# Altium project Shield.PrjPcb
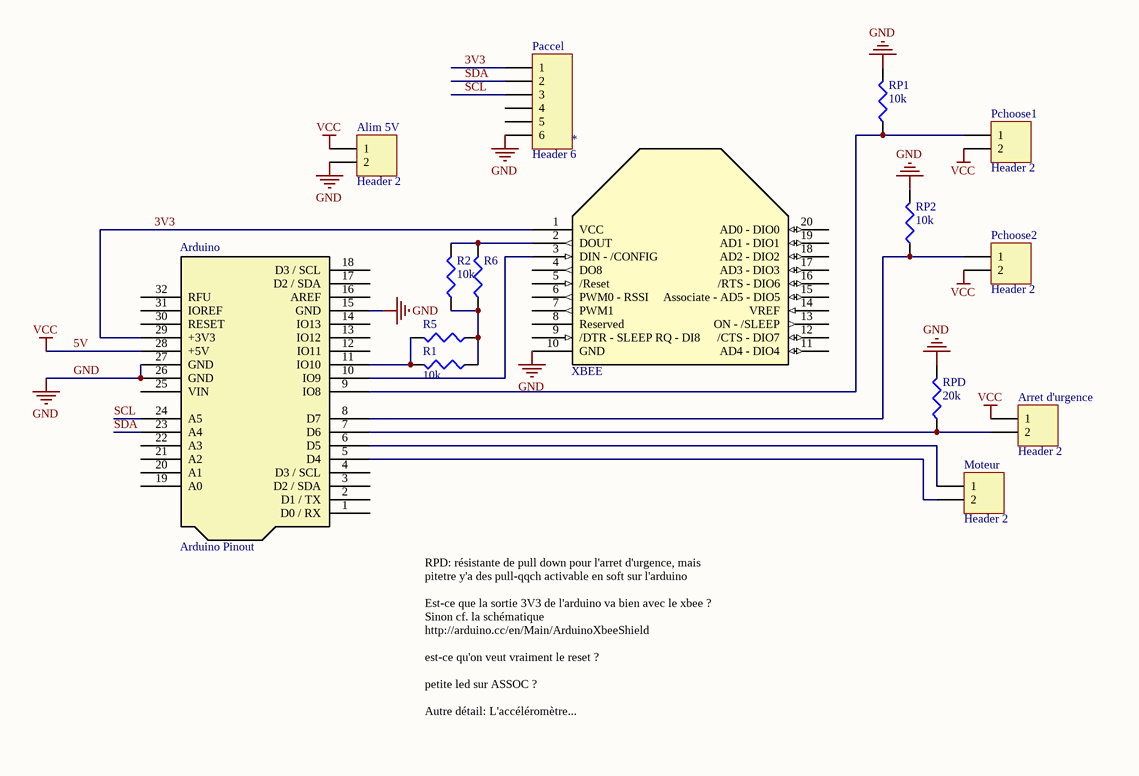
[diagram p0: Main.SchDoc]
1 sheet, 15 parts. Net scope: global (net labels, ports and power ports of the same name join across sheets).

## Sheet Main.SchDoc
size A4

### Parts
*  XBEE  [XBEE]
Alim_5V  Header 2  [TERM2W-3.5]
Arduino  Arduino Pinout  [Arduino]
Arret_d'urgence  Header 2  [HDR1X2]
Moteur  Header 2  [HDR1X2]
Paccel  Header 6  [HDR1X6]
Pchoose1  Header 2  [HDR1X2]
Pchoose2  Header 2  [HDR1X2]
R1  value 10k  [AXIAL0.8]  (hidden comment: RES)
R2  value 10k  [AXIAL0.8]  (hidden comment: RES)
R5  RES  [AXIAL0.8]  (value not drawn)
R6  RES  [AXIAL0.8]  (value not drawn)
RP1  value 10k  [AXIAL0.8]  (hidden comment: RES)
RP2  value 10k  [AXIAL0.8]  (hidden comment: RES)
RPD  value 20k  [AXIAL0.8]  (hidden comment: RES)

### Nets
5V: Alim_5V.1 Arduino.28(+5V) Arret_d'urgence.1 Pchoose1.2 Pchoose2.2  [also labelled VCC]
GND: *.10(GND) Alim_5V.2 Arduino.15(GND) Arduino.26(GND) Arduino.27(GND) Paccel.6 RP1.2 RP2.2 RPD.2
3V3: *.1(VCC) Arduino.29(+3V3) Paccel.1
SCL: Arduino.24(A5) Paccel.3
SDA: Arduino.23(A4) Paccel.2
Net*_2: *.2(DOUT) R2.2 R6.2
Net*_3: *.3(DIN_-_/CONFIG) Arduino.10(IO9)
NetArduino_5: Arduino.5(D4) Moteur.2
NetArduino_6: Arduino.6(D5) Moteur.1
NetArduino_7: Arduino.7(D6) Arret_d'urgence.2 RPD.1
NetArduino_8: Arduino.8(D7) Pchoose2.1 RP2.1
NetArduino_9: Arduino.9(IO8) Pchoose1.1 RP1.1
NetArduino_11: Arduino.11(IO10) R1.2 R5.2
NetR1_1: R1.1 R2.1 R5.1 R6.1

Not connected (* = marked no-connect by the designer): * 4(DO8) 5(/Reset) 6(PWM0_-_RSSI) 7(PWM1) 8(Reserved) 9(/DTR_-_SLEEP_RQ_-_DI8) 11(AD4_-_DIO4) 12(/CTS_-_DIO7) 13(ON_-_/SLEEP) 14(VREF) 15(Associate_-_AD5_-_DIO5) 16(/RTS_-_DIO6) 17(AD3_-_DIO3) 18(AD2_-_DIO2) 19(AD1_-_DIO1) 20(AD0_-_DIO0); Arduino 1(D0_/_RX) 2(D1_/_TX) 3(D2_/_SDA) 4(D3_/_SCL) 12(IO11) 13(IO12) 14(IO13) 16(AREF) 17(D2_/_SDA) 18(D3_/_SCL) 19(A0) 20(A1) 21(A2) 22(A3) 25(VIN) 30(RESET) 31(IOREF) 32(RFU); Paccel 4 5

### Notes on the sheet
- RPD: résistante de pull down pour l'arret d'urgence, mais pitetre y'a des pull-qqch activable en soft sur l'arduino
  Est-ce que la sortie 3V3 de l'arduino va bien avec le xbee ? Sinon cf. la schématique http://arduino.cc/en/Main/ArduinoXbeeShield
  est-ce qu'on veut vraiment le reset ?
  petite led sur ASSOC ?
  Autre détail: L'accéléromètre...

### Library data of the parts
* = XBEE: XBEE (Pro ou pas)
Alim_5V Arret_d'urgence Moteur Pchoose1 Pchoose2 = Header 2: Header, 2-Pin; LatestRevisionDate: 17-Jul-2002; LatestRevisionNote: Re-released for DXP Platform.; Publisher: Altium Limited
Arduino = arduino
Paccel = Header 6: Header, 6-Pin; LatestRevisionDate: 17-Jul-2002; LatestRevisionNote: Re-released for DXP Platform.; Publisher: Altium Limited
R1 R2 R5 R6 RP1 RP2 RPD = RES: Resistor; Published: 8-Jun-2000; LatestRevisionDate: 29-May-2009; LatestRevisionNote: IPC-7351 Footprint Added.; PackageReference: J1-0603; Publisher: Altium Limited; PackageDescription: Chip Resistor